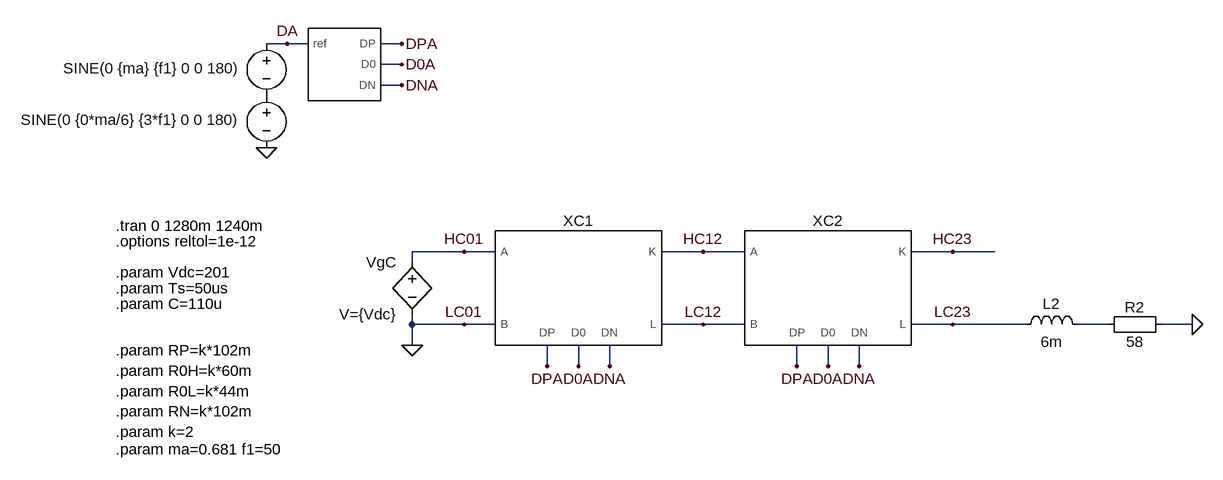
[diagram p0: schematic experiment R.asc]
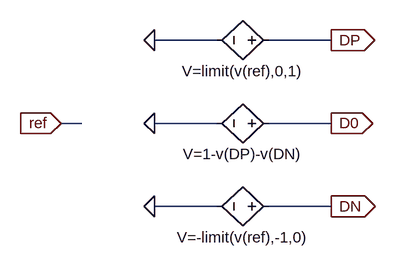
[diagram p1: sub-circuit pn_average_modulator.asc]
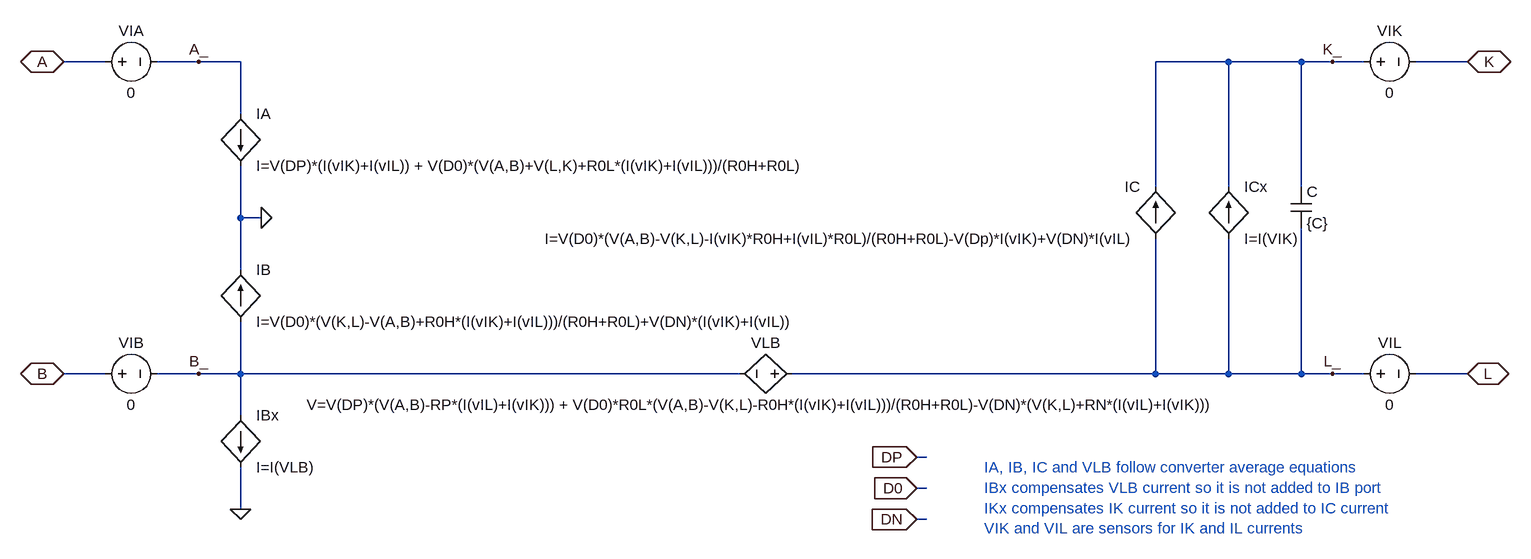
[diagram p2: sub-circuit pn_average_model.asc]
experiment R.asc, the LTspice schematic file:
Version 4
SHEET 1 4616 1844
WIRE 1744 -1376 1712 -1376
WIRE 1776 -1376 1744 -1376
WIRE 1920 -1376 1888 -1376
WIRE 1920 -1344 1888 -1344
WIRE 1920 -1312 1888 -1312
WIRE 2016 -1056 1936 -1056
WIRE 2064 -1056 2016 -1056
WIRE 2384 -1056 2320 -1056
WIRE 2448 -1056 2384 -1056
WIRE 2768 -1056 2704 -1056
WIRE 2832 -1056 2768 -1056
WIRE 1936 -1040 1936 -1056
WIRE 1936 -944 1936 -960
WIRE 2016 -944 1936 -944
WIRE 2064 -944 2016 -944
WIRE 2384 -944 2320 -944
WIRE 2448 -944 2384 -944
WIRE 2768 -944 2704 -944
WIRE 2880 -944 2768 -944
WIRE 3008 -944 2960 -944
WIRE 3136 -944 3088 -944
WIRE 1936 -912 1936 -944
WIRE 2144 -880 2144 -912
WIRE 2192 -880 2192 -912
WIRE 2240 -880 2240 -912
WIRE 2528 -880 2528 -912
WIRE 2576 -880 2576 -912
WIRE 2624 -880 2624 -912
FLAG 1920 -1376 DPA
FLAG 1920 -1344 D0A
FLAG 1920 -1312 DNA
FLAG 1712 -1216 0
FLAG 1744 -1376 DA
FLAG 2144 -880 DPA
FLAG 2192 -880 D0A
FLAG 2240 -880 DNA
FLAG 1936 -912 0
FLAG 2528 -880 DPA
FLAG 2576 -880 D0A
FLAG 2624 -880 DNA
FLAG 2016 -1056 HC01
FLAG 2384 -1056 HC12
FLAG 2768 -1056 HC23
FLAG 2016 -944 LC01
FLAG 2384 -944 LC12
FLAG 2768 -944 LC23
FLAG 3136 -944 0
SYMBOL voltage 1712 -1392 M0
WINDOW 0 24 16 Invisible 2
WINDOW 3 39 54 Left 2
SYMATTR InstName V1
SYMATTR Value SINE(0 {ma} {f1} 0 0 180)
SYMBOL voltage 1712 -1312 M0
WINDOW 0 24 16 Invisible 2
WINDOW 3 39 53 Left 2
SYMATTR InstName V7
SYMATTR Value SINE(0 {0*ma/6} {3*f1} 0 0 180)
SYMBOL PN_average_modulator 1824 -1344 R0
WINDOW 0 8 -56 Invisible 2
SYMATTR InstName X2
SYMBOL bv 1936 -1056 M0
SYMATTR InstName VgC
SYMATTR Value V={Vdc}
SYMBOL PN_average_model 2192 -1008 R0
SYMATTR InstName XC1
SYMATTR SpiceLine C={2*C} RP={RP} R0H={R0H} R0L={R0L} RN={RN}
SYMBOL PN_average_model 2576 -1008 R0
SYMATTR InstName XC2
SYMATTR SpiceLine C={C} RP={RP} R0H={R0H} R0L={R0L} RN={RN}
SYMBOL ind 2864 -928 R270
WINDOW 0 32 56 VTop 2
WINDOW 3 5 56 VBottom 2
SYMATTR InstName L2
SYMATTR Value 6m
SYMBOL Misc/EuropeanResistor 3104 -960 R90
WINDOW 0 5 56 VBottom 2
WINDOW 3 27 56 VTop 2
SYMATTR InstName R2
SYMATTR Value 58
TEXT 1480 -1000 Left 2 !.param Ts=50us
TEXT 1480 -1096 Left 2 !.tran 0 1280m 1240m
TEXT 1480 -1024 Left 2 !.param Vdc=201
TEXT 1480 -752 Left 2 !.param ma=0.681 f1=50
TEXT 1480 -904 Left 2 !.param RP=k*102m\n.param R0H=k*60m\n.param R0L=k*44m\n.param RN=k*102m\n.param k=2
TEXT 1480 -976 Left 2 !.param C=110u
TEXT 1480 -1072 Left 2 !.options reltol=1e-12

pn_average_modulator.asc, the sub-circuit schematic file:
Version 4
SHEET 1 880 680
WIRE 304 160 208 160
WIRE 480 160 384 160
WIRE 96 288 64 288
WIRE 304 288 208 288
WIRE 480 288 384 288
WIRE 304 416 208 416
WIRE 480 416 384 416
FLAG 208 160 0
FLAG 208 288 0
FLAG 208 416 0
FLAG 480 160 DP
IOPIN 480 160 Out
FLAG 480 288 D0
IOPIN 480 288 Out
FLAG 480 416 DN
IOPIN 480 416 Out
FLAG 64 288 ref
IOPIN 64 288 In
SYMBOL bv 400 160 R90
WINDOW 0 -32 56 Invisible 2
WINDOW 3 32 56 VTop 2
SYMATTR InstName Bpos1
SYMATTR Value V=limit(v(ref),0,1)
SYMBOL bv 400 288 R90
WINDOW 0 -32 56 Invisible 2
WINDOW 3 32 56 VTop 2
SYMATTR InstName Bzero1
SYMATTR Value V=1-v(DP)-v(DN)
SYMBOL bv 400 416 R90
WINDOW 0 -32 56 Invisible 2
WINDOW 3 32 56 VTop 2
SYMATTR InstName Bneg1
SYMATTR Value V=-limit(v(ref),-1,0)

pn_average_model.asc, the sub-circuit schematic file:
Version 4
SHEET 1 2060 780
WIRE -720 16 -784 16
WIRE -576 16 -640 16
WIRE -512 16 -576 16
WIRE 1008 16 896 16
WIRE 1120 16 1008 16
WIRE 1168 16 1120 16
WIRE 1216 16 1168 16
WIRE 1376 16 1296 16
WIRE -512 96 -512 16
WIRE 896 208 896 16
WIRE 1008 208 1008 16
WIRE 1120 208 1120 16
WIRE -512 256 -512 176
WIRE -480 256 -512 256
WIRE -512 336 -512 256
WIRE -720 496 -784 496
WIRE -576 496 -640 496
WIRE -512 496 -512 416
WIRE -512 496 -576 496
WIRE 256 496 -512 496
WIRE 896 496 896 288
WIRE 896 496 336 496
WIRE 1008 496 1008 288
WIRE 1008 496 896 496
WIRE 1120 496 1120 272
WIRE 1120 496 1008 496
WIRE 1168 496 1120 496
WIRE 1216 496 1168 496
WIRE 1376 496 1296 496
WIRE -512 560 -512 496
WIRE 544 624 528 624
WIRE 544 672 528 672
WIRE -512 704 -512 640
WIRE 544 720 528 720
FLAG 1376 16 K
IOPIN 1376 16 BiDir
FLAG 1376 496 L
IOPIN 1376 496 BiDir
FLAG -784 16 A
IOPIN -784 16 BiDir
FLAG -784 496 B
IOPIN -784 496 BiDir
FLAG 528 624 DP
IOPIN 528 624 In
FLAG 528 672 D0
IOPIN 528 672 In
FLAG 528 720 DN
IOPIN 528 720 In
FLAG -480 256 0
FLAG -512 704 0
FLAG -576 16 A_
FLAG -576 496 B_
FLAG 1168 16 K_
FLAG 1168 496 L_
SYMBOL bv 352 496 R90
WINDOW 0 -32 56 VBottom 2
WINDOW 3 32 56 VTop 2
SYMATTR InstName VLB
SYMATTR Value V=V(DP)*(V(A,B)-RP*(I(vIL)+I(vIK))) + V(D0)*R0L*(V(A,B)-V(K,L)-R0H*(I(vIK)+I(vIL)))/(R0H+R0L)-V(DN)*(V(K,L)+RN*(I(vIL)+I(vIK)))
SYMBOL bi -512 96 R0
SYMATTR InstName IA
SYMATTR Value I=V(DP)*(I(vIK)+I(vIL)) + V(D0)*(V(A,B)+V(L,K)+R0L*(I(vIK)+I(vIL)))/(R0H+R0L)
SYMBOL cap 1104 208 R0
SYMATTR InstName C
SYMATTR Value {C}
SYMBOL bi 896 288 R180
WINDOW 0 24 80 Left 2
WINDOW 3 24 0 Left 2
SYMATTR InstName IC
SYMATTR Value I=V(D0)*(V(A,B)-V(K,L)-I(vIK)*R0H+I(vIL)*R0L)/(R0H+R0L)-V(Dp)*I(vIK)+V(DN)*I(vIL)
SYMBOL bi -512 416 M180
WINDOW 0 24 80 Left 2
WINDOW 3 24 0 Left 2
SYMATTR InstName IB
SYMATTR Value I=V(D0)*(V(K,L)-V(A,B)+R0H*(I(vIK)+I(vIL)))/(R0H+R0L)+V(DN)*(I(vIK)+I(vIL))
SYMBOL voltage 1200 496 R270
WINDOW 0 32 56 VTop 2
WINDOW 3 -32 56 VBottom 2
SYMATTR InstName VIL
SYMATTR Value 0
SYMBOL voltage 1200 16 R270
WINDOW 0 32 56 VTop 2
WINDOW 3 -32 56 VBottom 2
SYMATTR InstName VIK
SYMATTR Value 0
SYMBOL bi -512 560 R0
SYMATTR InstName IBx
SYMATTR Value I=I(VLB)
SYMBOL bi 1008 288 M180
WINDOW 0 24 80 Left 2
WINDOW 3 24 0 Left 2
SYMATTR InstName ICx
SYMATTR Value I=I(VIK)
SYMBOL voltage -736 496 R270
WINDOW 0 32 56 VTop 2
WINDOW 3 -32 56 VBottom 2
SYMATTR InstName VIB
SYMATTR Value 0
SYMBOL voltage -736 16 R270
WINDOW 0 32 56 VTop 2
WINDOW 3 -32 56 VBottom 2
SYMATTR InstName VIA
SYMATTR Value 0
TEXT 632 640 Left 2 ;IA, IB, IC and VLB follow converter average equations\nIBx compensates VLB current so it is not added to IB port\nIKx compensates IK current so it is not added to IC current\nVIK and VIL are sensors for IK and IL currents

The netlist it stands for:
* experiment R.asc
V1 DA P001 SINE(0 {ma} {f1} 0 0 180)
V7 P001 0 SINE(0 {0*ma/6} {3*f1} 0 0 180)
XX2 DA D0A DNA DPA pn_average_modulator
B§VgC HC01 0 V={Vdc}
XXC1 D0A DNA DPA HC01 0 HC12 LC12 pn_average_model params: C={2*C} RP={RP} R0H={R0H} R0L={R0L} RN={RN}
XXC2 D0A DNA DPA HC12 LC12 HC23 LC23 pn_average_model params: C={C} RP={RP} R0H={R0H} R0L={R0L} RN={RN}
L2 LC23 N001 6m
R2 0 N001 58

* block symbol definitions
.subckt pn_average_modulator ref D0 DN DP
Bpos1 DP 0 V=limit(v(ref),0,1)
Bzero1 D0 0 V=1-v(DP)-v(DN)
Bneg1 DN 0 V=-limit(v(ref),-1,0)
.ends pn_average_modulator

.subckt pn_average_model D0 DN DP A B K L
B§VLB L_ B_ V=V(DP)*(V(A,B)-RP*(I(vIL)+I(vIK))) + V(D0)*R0L*(V(A,B)-V(K,L)-R0H*(I(vIK)+I(vIL)))/(R0H+R0L)-V(DN)*(V(K,L)+RN*(I(vIL)+I(vIK)))
B§IA A_ 0 I=V(DP)*(I(vIK)+I(vIL)) + V(D0)*(V(A,B)+V(L,K)+R0L*(I(vIK)+I(vIL)))/(R0H+R0L)
C K_ L_ {C}
B§IC L_ K_ I=V(D0)*(V(A,B)-V(K,L)-I(vIK)*R0H+I(vIL)*R0L)/(R0H+R0L)-V(Dp)*I(vIK)+V(DN)*I(vIL)
B§IB B_ 0 I=V(D0)*(V(K,L)-V(A,B)+R0H*(I(vIK)+I(vIL)))/(R0H+R0L)+V(DN)*(I(vIK)+I(vIL))
VIL L_ L 0
VIK K_ K 0
B§IBx B_ 0 I=I(VLB)
B§ICx L_ K_ I=I(VIK)
VIB B B_ 0
VIA A A_ 0
* IA, IB, IC and VLB follow converter average equations
* IBx compensates VLB current so it is not added to IB port
* IKx compensates IK current so it is not added to IC current
* VIK and VIL are sensors for IK and IL currents
.ends pn_average_model

.param Ts=50us
.tran 0 1280m 1240m
.param Vdc=201
.param ma=0.681 f1=50
.param RP=k*102m
.param R0H=k*60m
.param R0L=k*44m
.param RN=k*102m
.param k=2
.param C=110u
.options reltol=1e-12
.backanno
.end